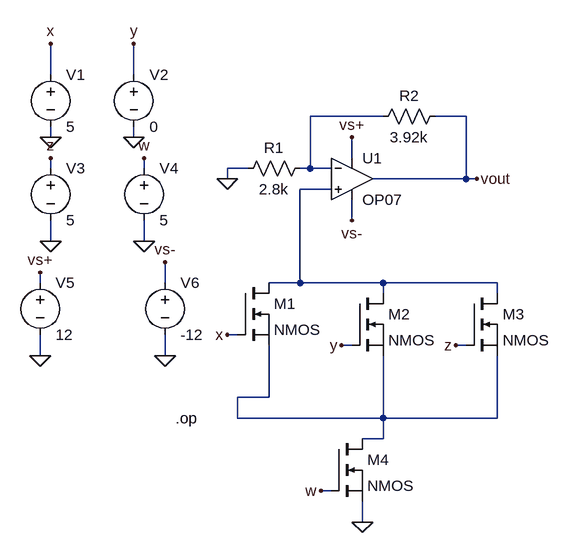
[diagram p0: schematic 3.asc]
3.asc, the LTspice schematic file:
Version 4
SHEET 1 880 724
WIRE -128 16 -128 -32
WIRE 0 16 0 -32
WIRE 384 80 272 80
WIRE 512 80 464 80
WIRE -128 112 -128 96
WIRE 0 112 0 96
WIRE 336 144 336 112
WIRE -128 160 -128 144
WIRE 16 160 16 144
WIRE 176 160 144 160
WIRE 272 160 272 80
WIRE 272 160 256 160
WIRE 304 160 272 160
WIRE 144 176 144 160
WIRE 512 176 512 80
WIRE 512 176 368 176
WIRE 528 176 512 176
WIRE 304 192 256 192
WIRE 336 240 336 208
WIRE -128 272 -128 240
WIRE 16 272 16 240
WIRE -144 336 -144 320
WIRE 48 336 48 304
WIRE 256 336 256 192
WIRE 256 336 208 336
WIRE 384 336 256 336
WIRE 560 336 384 336
WIRE 384 352 384 336
WIRE 560 352 560 336
WIRE 160 416 144 416
WIRE 336 432 320 432
WIRE 512 432 496 432
WIRE -144 448 -144 416
WIRE 48 448 48 416
WIRE 208 512 208 432
WIRE 208 512 160 512
WIRE 160 544 160 512
WIRE 384 544 384 448
WIRE 384 544 160 544
WIRE 560 544 560 448
WIRE 560 544 384 544
WIRE 384 576 384 544
WIRE 384 576 352 576
WIRE 304 656 288 656
WIRE 352 704 352 672
FLAG -128 112 0
FLAG 0 112 0
FLAG -128 272 0
FLAG 16 272 0
FLAG -144 448 0
FLAG 48 448 0
FLAG 144 176 0
FLAG -128 -32 x
FLAG 0 -32 y
FLAG -128 144 z
FLAG 16 144 w
FLAG -144 320 vs+
FLAG 48 304 vs-
FLAG 336 240 vs-
FLAG 336 112 vs+
FLAG 528 176 vout
FLAG 352 704 0
FLAG 144 416 x
FLAG 320 432 y
FLAG 496 432 z
FLAG 288 656 w
SYMBOL OpAmps\\OP07 336 112 R0
SYMATTR InstName U1
SYMBOL res 272 144 R90
WINDOW 0 0 56 VBottom 2
WINDOW 3 32 56 VTop 2
SYMATTR InstName R1
SYMATTR Value 2.8k
SYMBOL res 480 64 R90
WINDOW 0 0 56 VBottom 2
WINDOW 3 32 56 VTop 2
SYMATTR InstName R2
SYMATTR Value 3.92k
SYMBOL voltage -128 0 R0
WINDOW 123 0 0 Left 0
WINDOW 39 0 0 Left 0
SYMATTR InstName V1
SYMATTR Value 5
SYMBOL voltage 0 0 R0
WINDOW 123 0 0 Left 0
WINDOW 39 0 0 Left 0
SYMATTR InstName V2
SYMATTR Value 0
SYMBOL voltage -128 144 R0
WINDOW 123 0 0 Left 0
WINDOW 39 0 0 Left 0
SYMATTR InstName V3
SYMATTR Value 5
SYMBOL voltage 16 144 R0
WINDOW 123 0 0 Left 0
WINDOW 39 0 0 Left 0
SYMATTR InstName V4
SYMATTR Value 5
SYMBOL voltage -144 320 R0
WINDOW 123 0 0 Left 0
WINDOW 39 0 0 Left 0
SYMATTR InstName V5
SYMATTR Value 12
SYMBOL voltage 48 320 R0
WINDOW 123 0 0 Left 0
WINDOW 39 0 0 Left 0
SYMATTR InstName V6
SYMATTR Value -12
SYMBOL nmos 160 336 R0
SYMATTR InstName M1
SYMBOL nmos 336 352 R0
SYMATTR InstName M2
SYMBOL nmos 512 352 R0
SYMATTR InstName M3
SYMBOL nmos 304 576 R0
SYMATTR InstName M4
TEXT 64 544 Left 2 !.op

The netlist it stands for:
* 3.asc
XU1 N002 N001 vs+ vs- vout LT1001  ; OP07, pins In+ In- V+ V- OUT
R1 N001 0 2.8k
R2 vout N001 3.92k
V1 x 0 5
V2 y 0 0
V3 z 0 5
V4 w 0 5
V5 vs+ 0 12
V6 vs- 0 -12
M1 N002 x N003 N003 NMOS
M2 N002 y N003 N003 NMOS
M3 N002 z N003 N003 NMOS
M4 N003 w 0 0 NMOS
.model NMOS NMOS
.model PMOS PMOS
.lib standard.mos
.op
.lib LTC.lib
.backanno
.end